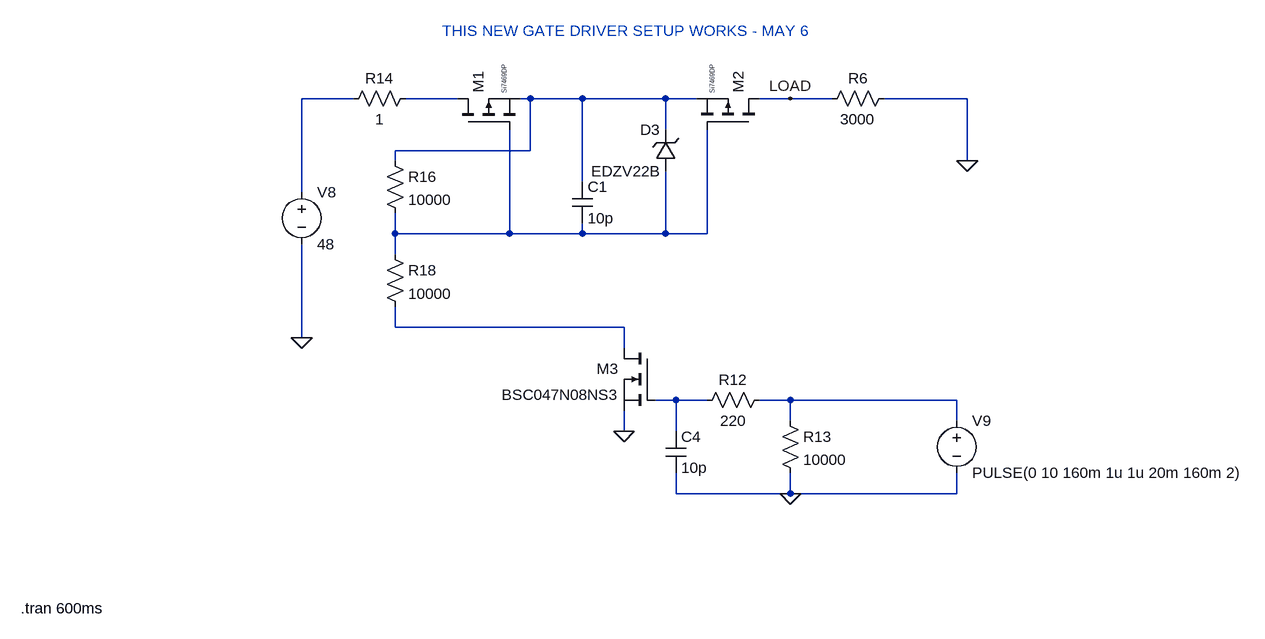
[diagram p0: schematic PMOS Bidirectional Switch OLD2.asc]
PMOS Bidirectional Switch OLD2.asc, the LTspice schematic file:
Version 4.1
SHEET 1 2720 2516
WIRE -768 400 -848 400
WIRE -608 400 -688 400
WIRE -496 400 -512 400
WIRE -416 400 -496 400
WIRE -288 400 -416 400
WIRE -240 400 -288 400
WIRE -96 400 -144 400
WIRE -32 400 -96 400
WIRE 176 400 48 400
WIRE -288 448 -288 400
WIRE -496 480 -496 400
WIRE -496 480 -704 480
WIRE -704 496 -704 480
WIRE 176 496 176 400
WIRE -416 528 -416 400
WIRE -848 544 -848 400
WIRE -704 608 -704 576
WIRE -528 608 -528 448
WIRE -528 608 -704 608
WIRE -416 608 -416 592
WIRE -416 608 -528 608
WIRE -288 608 -288 512
WIRE -288 608 -416 608
WIRE -224 608 -224 448
WIRE -224 608 -288 608
WIRE -704 640 -704 608
WIRE -704 752 -704 720
WIRE -352 752 -704 752
WIRE -848 768 -848 624
WIRE -352 784 -352 752
WIRE -272 864 -304 864
WIRE -224 864 -272 864
WIRE -96 864 -144 864
WIRE 160 864 -96 864
WIRE -96 896 -96 864
WIRE 160 896 160 864
WIRE -352 912 -352 880
WIRE -272 912 -272 864
WIRE -272 1008 -272 976
WIRE -96 1008 -96 976
WIRE -96 1008 -272 1008
WIRE 160 1008 160 976
WIRE 160 1008 -96 1008
FLAG 176 496 0
FLAG -848 768 0
FLAG -352 912 0
FLAG -96 1008 0
FLAG -96 400 LOAD
SYMBOL res 64 384 R90
WINDOW 0 0 56 VBottom 2
WINDOW 3 32 56 VTop 2
SYMATTR InstName R6
SYMATTR Value 3000
SYMBOL voltage -848 528 R0
WINDOW 123 0 0 Left 0
WINDOW 39 24 124 Left 2
SYMATTR InstName V8
SYMATTR Value 48
SYMBOL voltage 160 880 R0
WINDOW 123 0 0 Left 0
WINDOW 39 0 0 Left 0
SYMATTR InstName V9
SYMATTR Value PULSE(0 10 160m 1u 1u 20m 160m 2)
SYMBOL res -128 848 R90
WINDOW 0 0 56 VBottom 2
WINDOW 3 32 56 VTop 2
SYMATTR InstName R12
SYMATTR Value 220
SYMBOL res -112 880 R0
SYMATTR InstName R13
SYMATTR Value 10000
SYMBOL cap -288 912 R0
SYMATTR InstName C4
SYMATTR Value 10p
SYMBOL res -720 480 R0
SYMATTR InstName R16
SYMATTR Value 10000
SYMBOL res -720 624 R0
SYMATTR InstName R18
SYMATTR Value 10000
SYMBOL zener -272 512 R180
WINDOW 0 24 64 Left 2
WINDOW 3 24 0 Left 2
SYMATTR InstName D3
SYMATTR Value EDZV22B
SYMBOL res -672 384 R90
WINDOW 0 0 56 VBottom 2
WINDOW 3 32 56 VTop 2
SYMATTR InstName R14
SYMATTR Value 1
SYMBOL cap -432 528 R0
SYMATTR InstName C1
SYMATTR Value 10p
SYMBOL pmos -608 448 R270
WINDOW 3 56 72 Left 0
SYMATTR Value Si7469DP
SYMATTR InstName M1
SYMBOL pmos -144 448 M270
WINDOW 3 56 72 Left 0
SYMATTR Value Si7469DP
SYMATTR InstName M2
SYMBOL nmos -304 784 M0
SYMATTR InstName M3
SYMATTR Value BSC047N08NS3
TEXT -632 296 Left 2 ;THIS NEW GATE DRIVER SETUP WORKS - MAY 6
TEXT -1280 1184 Left 2 !.tran 600ms

The netlist it stands for:
* PMOS Bidirectional Switch OLD2.asc
R6 0 LOAD 3000
V8 N001 0 48
V9 N007 0 PULSE(0 10 160m 1u 1u 20m 160m 2)
R12 N007 N006 220
R13 N007 0 10000
C4 N006 0 10p
R16 N003 N004 10000
R18 N004 N005 10000
D3 N004 N003 EDZV22B
R14 N002 N001 1
C1 N003 N004 10p
M1 N002 N004 N003 N003 Si7469DP
M2 LOAD N004 N003 N003 Si7469DP
M3 N005 N006 0 0 BSC047N08NS3
.model D D
.lib standard.dio
.model NMOS NMOS
.model PMOS PMOS
.lib standard.mos
* THIS NEW GATE DRIVER SETUP WORKS - MAY 6
.tran 600ms
.backanno
.end